# EAGLE design tms9918 (EAGLE 9.4.2)

## Sheet 1 of 2: Bus interface
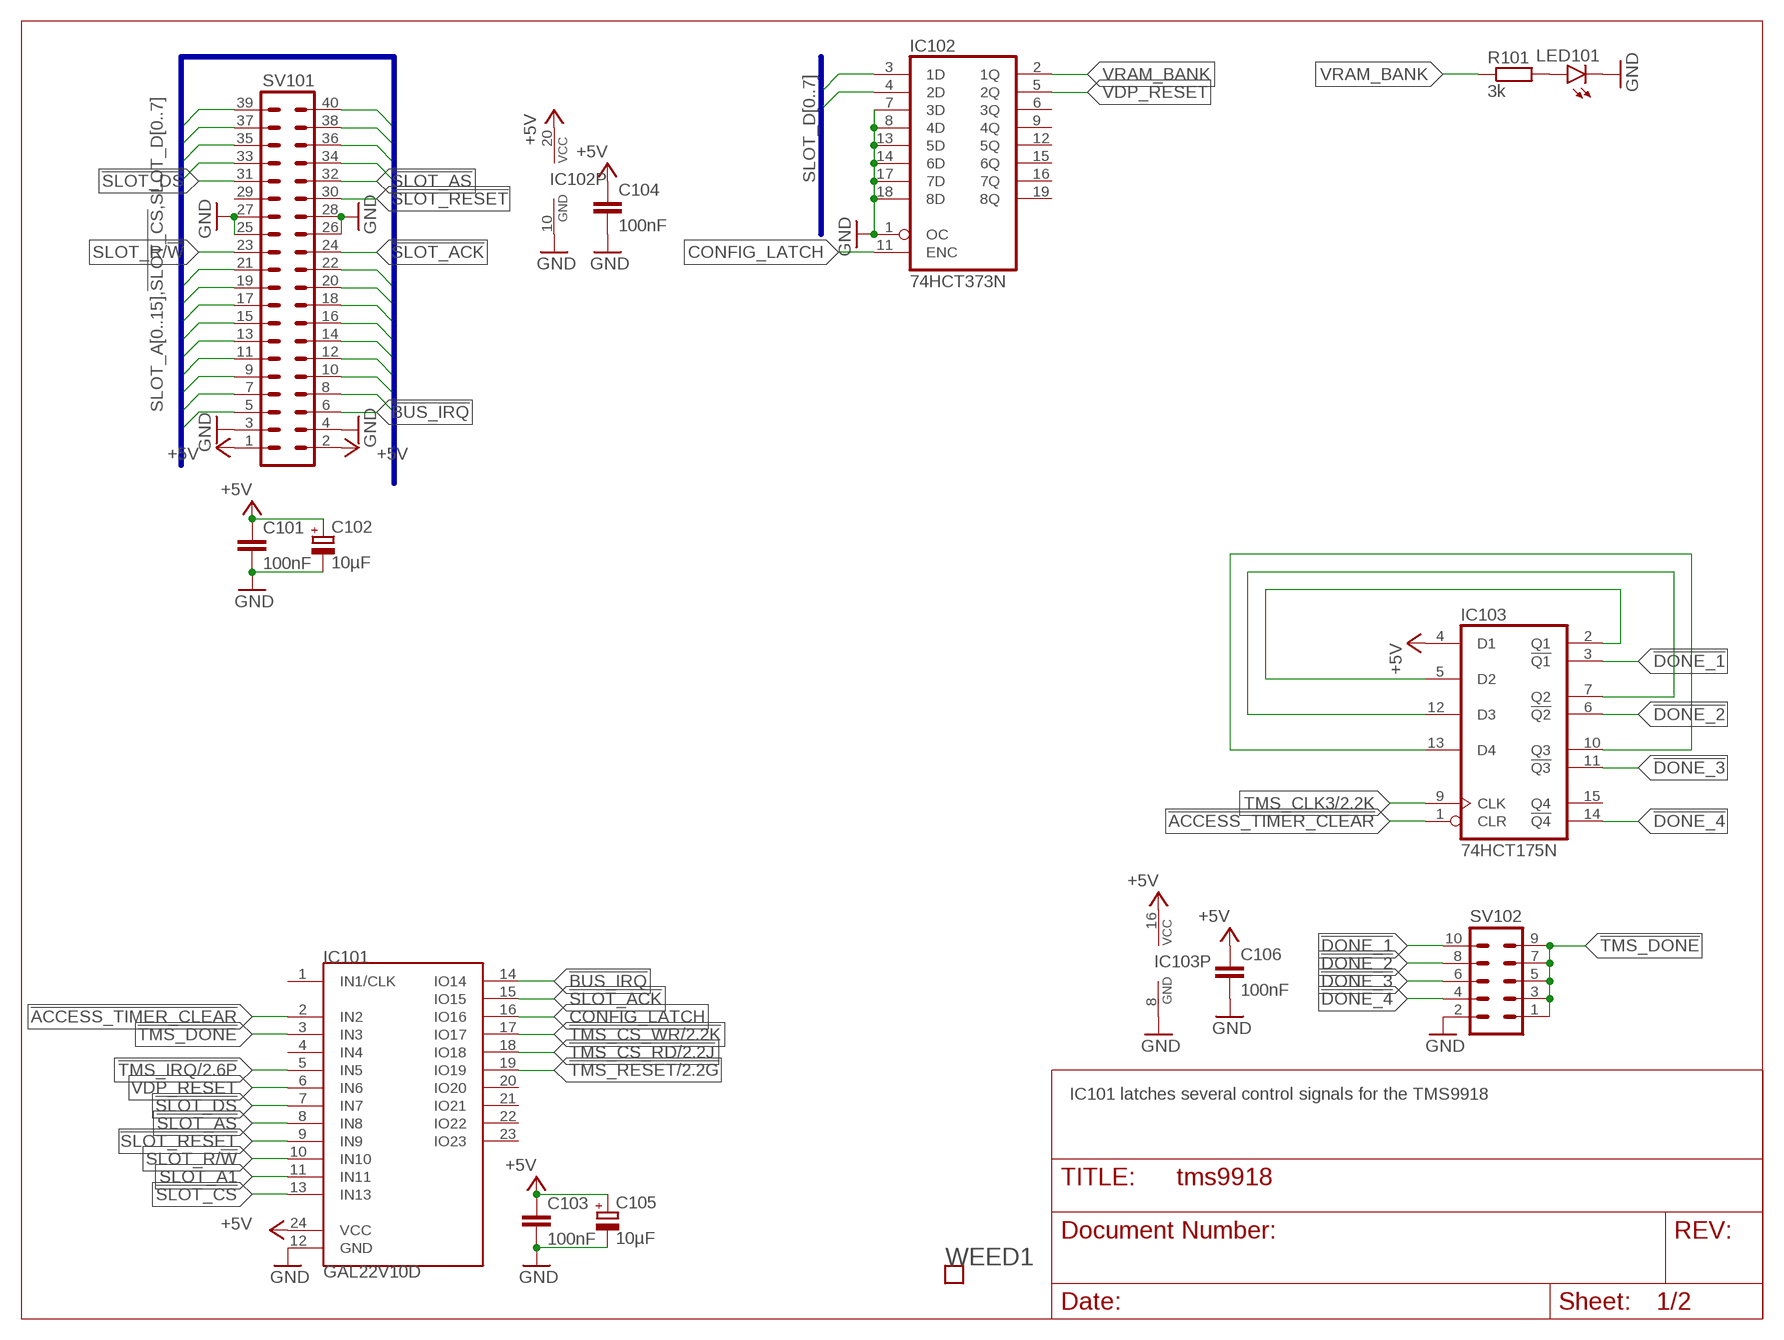
[diagram p0: schematic, sheet 1]

### Parts
C101  100nF  C-EUC0805  [C0805]
C102  10µF  CPOL-EUSMCB  [SMC_B]
C103  100nF  C-EUC0805  [C0805]
C104  100nF  C-EUC0805  [C0805]
C105  10µF  CPOL-EUSMCB  [SMC_B]
C106  100nF  C-EUC0805  [C0805]
IC101  GAL22V10D  GAL22V10DIP24  [DIL24S]
IC102  74HCT373N  [DIL20]
IC103  74HCT175N  [DIL16]
LED101  LEDCHIPLED_1206  [CHIPLED_1206]
R101  3k  R-EU_R2012  [R2012]
SV101  MA20-2W  [MA20-2W]
SV102  MA05-2  [MA05-2]
WEED1  WEED  [DOINK]

### Nets
!ACCESS_TIMER_CLEAR: IC101.2(IN2) IC103.1(CLR)
!BUS_IRQ: IC101.14(IO14) SV101.6
!DONE_1: IC103.3(!Q1) SV102.10
!DONE_2: IC103.6(!Q2) SV102.8
!DONE_3: IC103.11(!Q3) SV102.6
!DONE_4: IC103.14(!Q4) SV102.4
!SLOT_ACK: IC101.15(IO15) SV101.24
!SLOT_AS: IC101.8(IN8) SV101.32
!SLOT_CS: IC101.13(IN13) SV101.5
!SLOT_DS: IC101.7(IN7) SV101.31
!SLOT_RESET: IC101.9(IN9) SV101.30
!TMS_CS_RD: IC101.18(IO18) ; also sheet 2
!TMS_CS_WR: IC101.17(IO17) ; also sheet 2
!TMS_DONE: IC101.3(IN3) SV102.1 SV102.3 SV102.5 SV102.7 SV102.9
!TMS_IRQ: IC101.5(IN5) ; also sheet 2
!TMS_RESET: IC101.19(IO19) ; also sheet 2
+5V: C101.1 C102.+ C103.1 C104.1 C105.+ C106.1 IC101.24(VCC) IC102.20(VCC) IC103.4(D1) IC103.16(VCC) SV101.1 SV101.2 ; also sheet 2
CONFIG_LATCH: IC101.16(IO16) IC102.11(ENC)
GND: C101.2 C102.- C103.2 C104.2 C105.- C106.2 IC101.12(GND) IC102.1(OC) IC102.7(3D) IC102.8(4D) IC102.10(GND) IC102.13(5D) IC102.14(6D) IC102.17(7D) IC102.18(8D) IC103.8(GND) LED101.C SV101.3 SV101.4 SV101.25 SV101.26 SV101.27 SV101.28 SV102.2 ; also sheet 2
N$8: IC103.2(Q1) IC103.5(D2)
N$9: IC103.7(Q2) IC103.12(D3)
N$10: IC103.10(Q3) IC103.13(D4)
N$11: LED101.A R101.2
SLOT_A0: SV101.12 ; also sheet 2
SLOT_A1: IC101.11(IN11) SV101.10
SLOT_A2: SV101.8
SLOT_A3: SV101.7
SLOT_A4: SV101.9
SLOT_A5: SV101.11
SLOT_A6: SV101.14
SLOT_A7: SV101.13
SLOT_A8: SV101.16
SLOT_A9: SV101.15
SLOT_A10: SV101.18
SLOT_A11: SV101.17
SLOT_A12: SV101.20
SLOT_A13: SV101.19
SLOT_A14: SV101.22
SLOT_A15: SV101.21
SLOT_D0: IC102.3(1D) SV101.35 ; also sheet 2
SLOT_D1: IC102.4(2D) SV101.37 ; also sheet 2
SLOT_D2: SV101.39 ; also sheet 2
SLOT_D3: SV101.40 ; also sheet 2
SLOT_D4: SV101.38 ; also sheet 2
SLOT_D5: SV101.36 ; also sheet 2
SLOT_D6: SV101.34 ; also sheet 2
SLOT_D7: SV101.33 ; also sheet 2
SLOT_R/!W!: IC101.10(IN10) SV101.23
TMS_CLK3: IC103.9(CLK) ; also sheet 2
VDP_RESET: IC101.6(IN6) IC102.5(2Q)
VRAM_BANK: IC102.2(1Q) R101.1 ; also sheet 2
Unconnected: IC101.1(IN1/CLK) IC101.4(IN4) IC101.20(IO20) IC101.21(IO21) IC101.22(IO22) IC101.23(IO23) IC102.6(3Q) IC102.9(4Q) IC102.12(5Q) IC102.15(6Q) IC102.16(7Q) IC102.19(8Q) IC103.15(Q4) SV101.29

### Buses
SLOT_A[0..15],!SLOT_CS,SLOT_D[0..7]
SLOT_D[0..7]

### Notes on the sheet
- IC101 latches several control signals for the TMS9918

## Sheet 2 of 2: Video Controller/DRAM Emulation
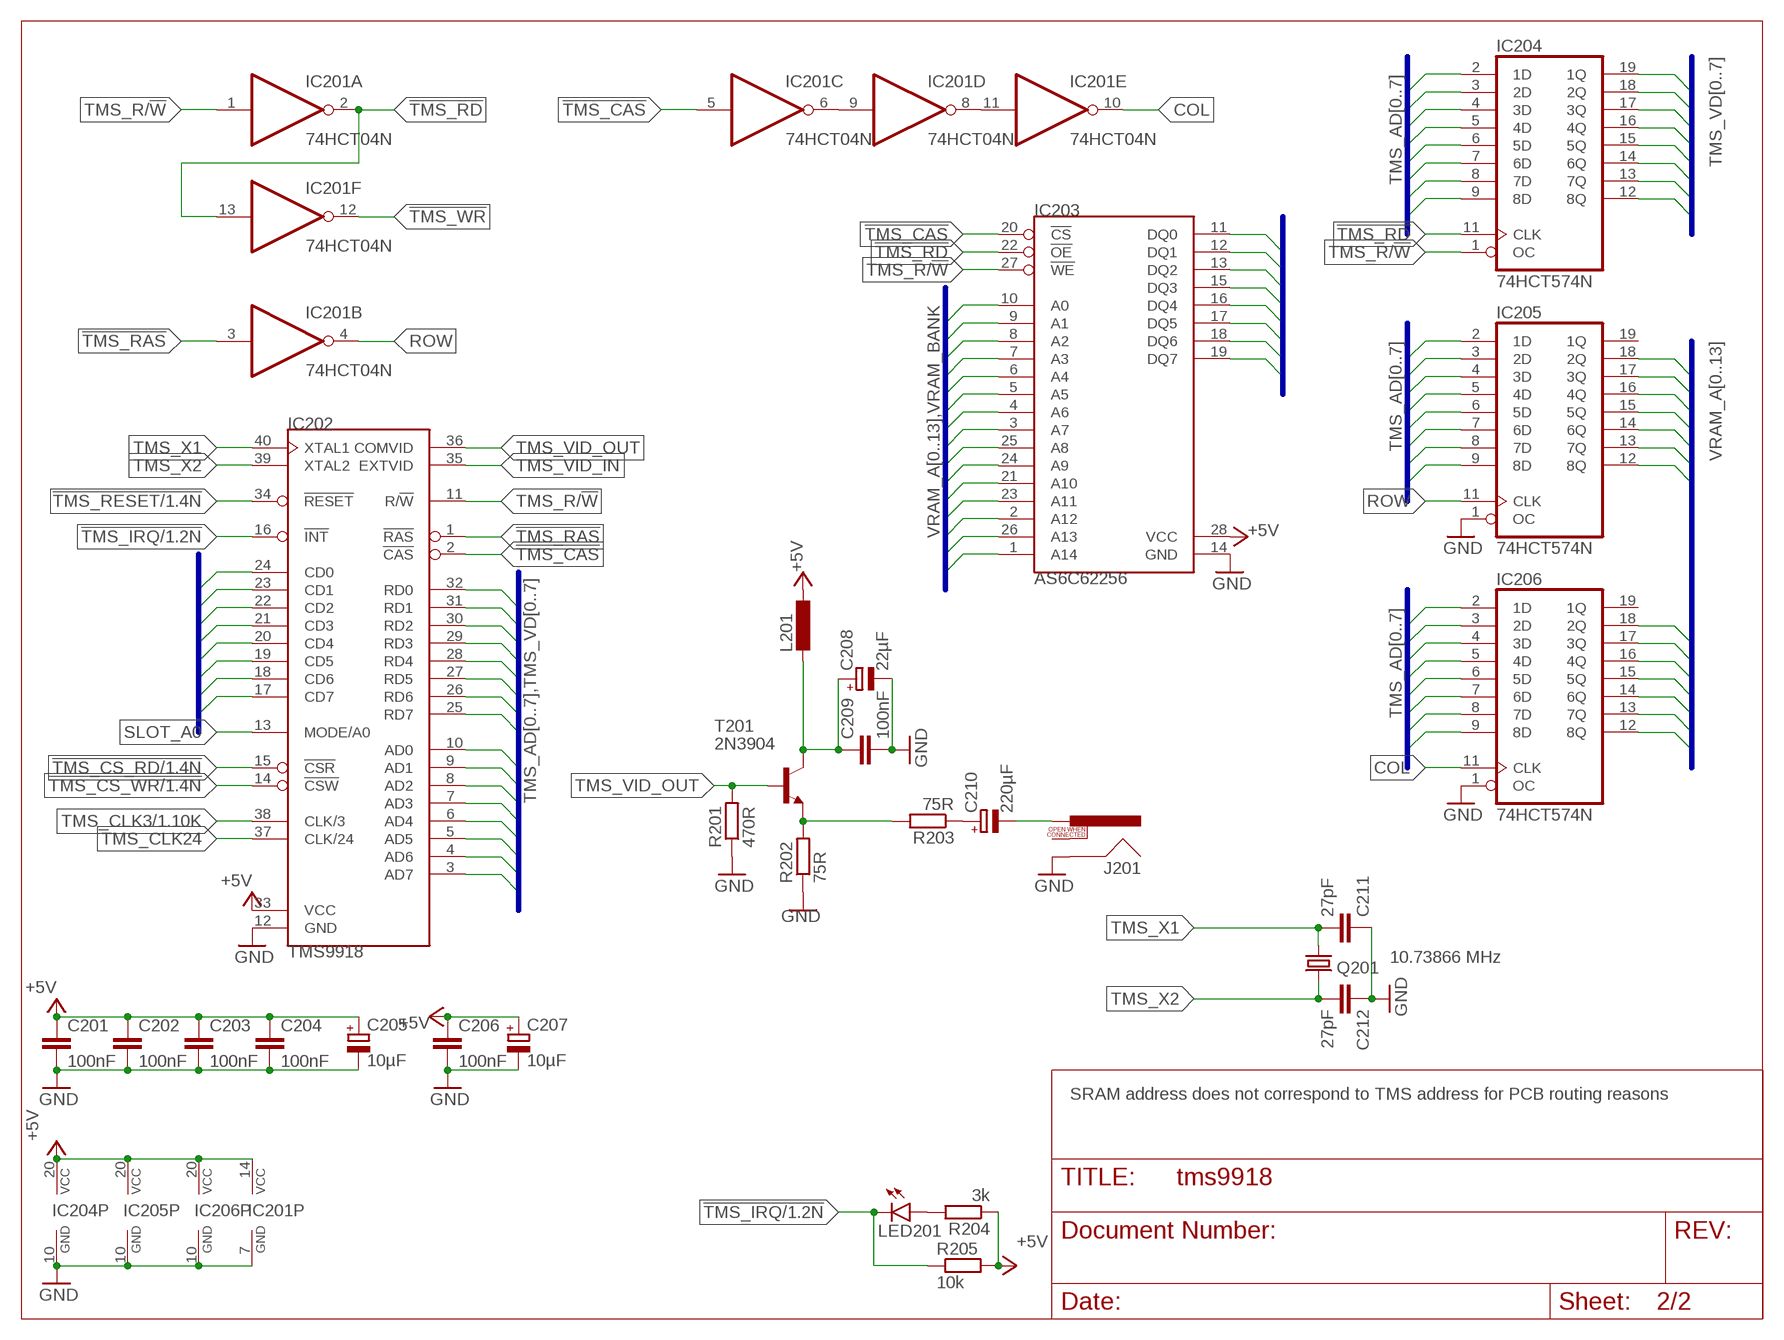
[diagram p1: schematic, sheet 2]

### Parts
C201  100nF  C-EUC0805  [C0805]
C202  100nF  C-EUC0805  [C0805]
C203  100nF  C-EUC0805  [C0805]
C204  100nF  C-EUC0805  [C0805]
C205  10µF  CPOL-EUSMCB  [SMC_B]
C206  100nF  C-EUC0805  [C0805]
C207  10µF  CPOL-EUSMCB  [SMC_B]
C208  22µF  CPOL-EUE2-5  [E2-5]
C209  100nF  C-EUC0805  [C0805]
C210  220µF  CPOL-EUE2.5-7  [E2,5-7]
C211  27pF  C-EUC0805  [C0805]
C212  27pF  C-EUC0805  [C0805]
IC201  74HCT04N  [DIL14]
IC202  TMS9918  [DIL40]
IC203  AS6C62256  [DIL28-6]
IC204  74HCT574N  [DIL20]
IC205  74HCT574N  [DIL20]
IC206  74HCT574N  [DIL20]
J201  RCALOCK  [RCA_LOCK]
L201  L-EUL2012C  [L2012C]
LED201  LEDCHIPLED_1206  [CHIPLED_1206]
Q201  10.73866 MHz  CRYSTALHC49S  [HC49/S]
R201  470R  R-EU_R2012  [R2012]
R202  75R  R-EU_R2012  [R2012]
R203  75R  R-EU_R2012  [R2012]
R204  3k  R-EU_R2012  [R2012]
R205  10k  R-EU_R2012  [R2012]
T201  2N3904  [TO92]

### Nets
!TMS_CAS: IC201.5(C:I) IC202.2(!CAS) IC203.20(!CS)
!TMS_CS_RD: IC202.15(!CSR) ; also sheet 1
!TMS_CS_WR: IC202.14(!CSW) ; also sheet 1
!TMS_IRQ: IC202.16(!INT) LED201.C R205.1 ; also sheet 1
!TMS_RAS: IC201.3(B:I) IC202.1(!RAS)
!TMS_RD: IC201.2(A:O) IC201.13(F:I) IC203.22(!OE) IC204.11(CLK)
!TMS_RESET: IC202.34(!RESET) ; also sheet 1
!TMS_WR: IC201.12(F:O)
+5V: C201.1 C202.1 C203.1 C204.1 C205.+ C206.1 C207.+ IC201.14(P:VCC) IC202.33(VCC) IC203.28(VCC) IC204.20(VCC) IC205.20(VCC) IC206.20(VCC) L201.1 R204.1 R205.2 ; also sheet 1
COL: IC201.10(E:O) IC206.11(CLK)
GND: C201.2 C202.2 C203.2 C204.2 C205.- C206.2 C207.- C208.- C209.2 C211.1 C212.1 IC201.7(P:GND) IC202.12(GND) IC203.14(GND) IC204.10(GND) IC205.1(OC) IC205.10(GND) IC206.1(OC) IC206.10(GND) J201.SHELL R201.1 R202.1 ; also sheet 1
N$1: IC201.8(D:O) IC201.11(E:I)
N$2: IC201.6(C:O) IC201.9(D:I)
N$3: C208.+ C209.1 L201.2 T201.1(C)
N$4: R202.2 R203.2 T201.3(E)
N$5: C210.+ R203.1
N$6: C210.- J201.PIN
N$7: LED201.A R204.2
ROW: IC201.4(B:O) IC205.11(CLK)
SLOT_A0: IC202.13(MODE/A0) ; also sheet 1
SLOT_D0: IC202.17(CD7) ; also sheet 1
SLOT_D1: IC202.18(CD6) ; also sheet 1
SLOT_D2: IC202.19(CD5) ; also sheet 1
SLOT_D3: IC202.20(CD4) ; also sheet 1
SLOT_D4: IC202.21(CD3) ; also sheet 1
SLOT_D5: IC202.22(CD2) ; also sheet 1
SLOT_D6: IC202.23(CD1) ; also sheet 1
SLOT_D7: IC202.24(CD0) ; also sheet 1
TMS_AD0: IC202.10(AD0) IC204.2(1D) IC205.9(8D) IC206.9(8D)
TMS_AD1: IC202.9(AD1) IC204.3(2D) IC205.8(7D) IC206.8(7D)
TMS_AD2: IC202.8(AD2) IC204.4(3D) IC205.7(6D) IC206.7(6D)
TMS_AD3: IC202.7(AD3) IC204.5(4D) IC205.6(5D) IC206.6(5D)
TMS_AD4: IC202.6(AD4) IC204.6(5D) IC205.5(4D) IC206.5(4D)
TMS_AD5: IC202.5(AD5) IC204.7(6D) IC205.4(3D) IC206.4(3D)
TMS_AD6: IC202.4(AD6) IC204.8(7D) IC205.3(2D) IC206.3(2D)
TMS_AD7: IC202.3(AD7) IC204.9(8D) IC205.2(1D) IC206.2(1D)
TMS_CLK3: IC202.38(CLK/3) ; also sheet 1
TMS_CLK24: IC202.37(CLK/24)
TMS_R/!W!: IC201.1(A:I) IC202.11(R/!W!) IC203.27(!WE) IC204.1(OC)
TMS_VD0: IC202.32(RD0) IC203.11(DQ0) IC204.19(1Q)
TMS_VD1: IC202.31(RD1) IC203.12(DQ1) IC204.18(2Q)
TMS_VD2: IC202.30(RD2) IC203.13(DQ2) IC204.17(3Q)
TMS_VD3: IC202.29(RD3) IC203.15(DQ3) IC204.16(4Q)
TMS_VD4: IC202.28(RD4) IC203.16(DQ4) IC204.15(5Q)
TMS_VD5: IC202.27(RD5) IC203.17(DQ5) IC204.14(6Q)
TMS_VD6: IC202.26(RD6) IC203.18(DQ6) IC204.13(7Q)
TMS_VD7: IC202.25(RD7) IC203.19(DQ7) IC204.12(8Q)
TMS_VID_IN: IC202.35(EXTVID)
TMS_VID_OUT: IC202.36(COMVID) R201.2 T201.2(B)
TMS_X1: C211.2 IC202.40(XTAL1) Q201.1
TMS_X2: C212.2 IC202.39(XTAL2) Q201.2
VRAM_A0: IC203.10(A0) IC205.12(8Q)
VRAM_A1: IC203.9(A1) IC205.13(7Q)
VRAM_A2: IC203.8(A2) IC205.14(6Q)
VRAM_A3: IC203.7(A3) IC205.15(5Q)
VRAM_A4: IC203.6(A4) IC205.16(4Q)
VRAM_A5: IC203.5(A5) IC205.17(3Q)
VRAM_A6: IC203.4(A6) IC205.18(2Q)
VRAM_A7: IC203.3(A7) IC206.17(3Q)
VRAM_A8: IC203.25(A8) IC206.15(5Q)
VRAM_A9: IC203.24(A9) IC206.14(6Q)
VRAM_A10: IC203.21(A10) IC206.12(8Q)
VRAM_A11: IC203.23(A11) IC206.13(7Q)
VRAM_A12: IC203.2(A12) IC206.18(2Q)
VRAM_A13: IC203.26(A13) IC206.16(4Q)
VRAM_BANK: IC203.1(A14) ; also sheet 1
Unconnected: IC205.19(1Q) IC206.19(1Q) J201.SWITCH

### Buses
TMS_VD[0..7]
VRAM_A[0..13]
TMS_AD[0..7]
VRAM_A[0..13],VRAM_BANK
TMS_AD[0..7],TMS_VD[0..7]
SLOT_D[0..7]

### Notes on the sheet
- SRAM address does not correspond to TMS address for PCB routing reasons

## Library data of the parts
C101 C103 C104 C106 C201-C204 C206 C209 = rcl:C-EU: CAPACITOR, European symbol; MOUSER: 710-885012207072; SPICEPREFIX: C
C102 C105 C205 C207 = rcl:CPOL-EU: POLARIZED CAPACITOR, European symbol; MOUSER: 581-TAJB106K020RNJV; SPICEPREFIX: C
C208 = rcl:CPOL-EU: POLARIZED CAPACITOR, European symbol; MOUSER: 710-860010372002; SPICEPREFIX: C
C210 = rcl:CPOL-EU: POLARIZED CAPACITOR, European symbol; MOUSER: 710-860020373010; SPICEPREFIX: C
C211 C212 = rcl:C-EU: CAPACITOR, European symbol; MOUSER: 80-C0805C270K5HACTU; SPICEPREFIX: C
IC101 = 68komputer:GAL22V10: GAL22V10D – Generic Array Logic Datasheet <http://web.mit.edu/6.115/www/document/gal22v10.pdf>; MOUSER_SOCKET: 575-11044324
IC102 = 74xx-eu:74*373: Octal D type transparent LATCH, edge triggered; MOUSER: 595-SN74HCT373N; MOUSER_SOCKET: 575-1104732041001000
IC103 = 74xx-eu:74*175: Qadruple D type FLIP FLOP, clear; MOUSER: 595-CD74HCT175E; MOUSER_SOCKET: 575-1104731641001000
IC201 = 74xx-eu:74*04: Hex INVERTER; MOUSER: 595-SN74HCT04N; MOUSER_SOCKET: 575-1104731441001000
IC202 = 68komputer:TMS9918: TMSS9918 – Video Display Processor Datasheet <http://www.bitsavers.org/components/ti/TMS9900/TMS9918A_TMS9928A_TMS9929A_Video_Display_Processors_Data_Manual_Nov82.pdf>; MOUSER_SOCKET: 437-1108764041001101
IC203 = 68komputer:AS6C62256: AS6C62256 – 32K x 8 bit SRAM Datasheet <https://www.mouser.com/datasheet/2/12/AS6C62256%2023%20March%202016%20rev1.2-1288423.pdf>; MOUSER: 913-AS6C62256-55PCN; MOUSER_SOCKET: 575-1104762841001000
IC204-IC206 = 74xx-eu:74*574: 8-bit D type FLIP FLOP bus driver; MOUSER: 595-SN74HCT574N; MOUSER_SOCKET: 575-1104732041001000
J201 = SparkFun-Connectors:RCA: RCA Jack connector This is a right angle RCA jack connecotr. Commonly used for video or audio. Here is the connector we sell at SparkFun: RCA Jack <https://www.sparkfun.com/products/8631> (PRT-08631) Datasheet <http://www.sparkfun.com/datasheets/Prototyping/Connectors/RCA-Jack.pdf> It is not used on any active designs, however it was used on a couple retired products: RCA Jack Breakout [RETIRED] <https://www.sparkfun.com/products/8826> (PRT-08826) SparkFun On Screen Display Breakout - MAX7456 [RETIRED] <https://www.sparkfun.com/products/9168> (BOB-09168) You may also be interested in a cable: RCA Video Cable - 6' <https://www.sparkfun.com/products/11573> (CAB-11573); MOUSER: 502-PJRAN1X1U04AU
L201 = rcl:L-EU: INDUCTOR, European symbol; MOUSER: 963-BK2125HS101-T; SPICEPREFIX: L
LED101 LED201 = led:LED: LED OSRAM: - CHIPLED LG R971, LG N971, LY N971, LG Q971, LY Q971, LO R971, LY R971 LH N974, LH R974 LS Q976, LO Q976, LY Q976 LO Q996 - Hyper CHIPLED LW Q18S LB Q993, LB Q99A, LB R99A - SideLED LS A670, LO A670, LY A670, LG A670, LP A670 LB A673, LV A673, LT A673, LW A673 LH A674 LY A675 LS A676, LA A676, LO A676, LY A676, LW A676 LS A679, LY A679, LG A679 - Hyper Micro SIDELED® LS Y876, LA Y876, LO Y876, LY Y876 LT Y87S - SmartLED LW L88C, LW L88S LB L89C, LB L89S, LG L890 LS L89K, LO L89K, LY L89K LS L896, LA L896, LO L896, LY L896 - TOPLED LS T670, LO T670, LY T670, LG T670, LP T670 LSG T670, LSP T670, LSY T670, LOP T670, LYG T670 LG T671, LOG T671, LSG T671 LB T673, LV T673, LT T673, LW T673 LH T674 LS T676, LA T676, LO T676, LY T676, LB T676, LH T676, LSB T676, LW T676 LB T67C, LV T67C, LT T67C, LS T67K, LO T67K, LY T67K, LW E67C LS E67B, LA E67B, LO E67B, LY E67B, LB E67C, LV E67C, LT E67C LW T67C LS T679, LY T679, LG T679 LS T770, LO T770, LY T770, LG T770, LP T770 LB T773, LV T773, LT T773, LW T773 LH T774 LS E675, LA E675, LY E675, LS T675 LS T776, LA T776, LO T776, LY T776, LB T776 LHGB T686 LT T68C, LB T68C - Hyper Mini TOPLED® LB M676 - Mini TOPLED Santana® LG M470 LS M47K, LO M47K, LY M47K Source: http://www.osram.convergy.de LUXEON: - LUMILED® LXK2-PW12-R00, LXK2-PW12-S00, LXK2-PW14-U00, LXK2-PW14-V00 LXK2-PM12-R00, LXK2-PM12-S00, LXK2-PM14-U00 LXK2-PE12-Q00, LXK2-PE12-R00, LXK2-PE12-S00, LXK2-PE14-T00, LXK2-PE14-U00 LXK2-PB12-K00, LXK2-PB12-L00, LXK2-PB12-M00, LXK2-PB14-N00, LXK2-PB14-P00, LXK2-PB14-Q00 LXK2-PR12-L00, LXK2-PR12-M00, LXK2-PR14-Q00, LXK2-PR14-R00 LXK2-PD12-Q00, LXK2-PD12-R00, LXK2-PD12-S00 LXK2-PH12-R00, LXK2-PH12-S00 LXK2-PL12-P00, LXK2-PL12-Q00, LXK2-PL12-R00 Source: www.luxeon.com KINGBRIGHT: KA-3528ASYC Source: www.kingbright.com; MOUSER: 710-156120VS75300
Q201 = crystal:CRYSTAL: CRYSTAL; MOUSER: 449-LFXTAL029962REEL; OC_FARNELL: 1667008; OC_NEWARK: unknown
R101 R204 = rcl:R-EU_: RESISTOR, European symbol; MOUSER: 652-CR0805JW-302ELF; SPICEPREFIX: R
R201 = rcl:R-EU_: RESISTOR, European symbol; MOUSER: 652-CR0805FX-4700ELF; SPICEPREFIX: R
R202 R203 = rcl:R-EU_: RESISTOR, European symbol; MOUSER: 652-CR0805FX-75R0ELF; SPICEPREFIX: R
R205 = rcl:R-EU_: RESISTOR, European symbol; MOUSER: 652-CR0805FX-1002ELF; SPICEPREFIX: R
SV101 = con-lstb:MA20-2W: PIN HEADER; OC_FARNELL: unknown; OC_NEWARK: unknown
SV102 = con-lstb:MA05-2: PIN HEADER; OC_FARNELL: unknown; OC_NEWARK: unknown
T201 = transistor-neu-to92:2N3904: NPN TRANSISTOR; MOUSER: 512-2N3904BU
WEED1 = 68komputer:WEED

## Net classes
0 default: width 0.203 mm

## Board
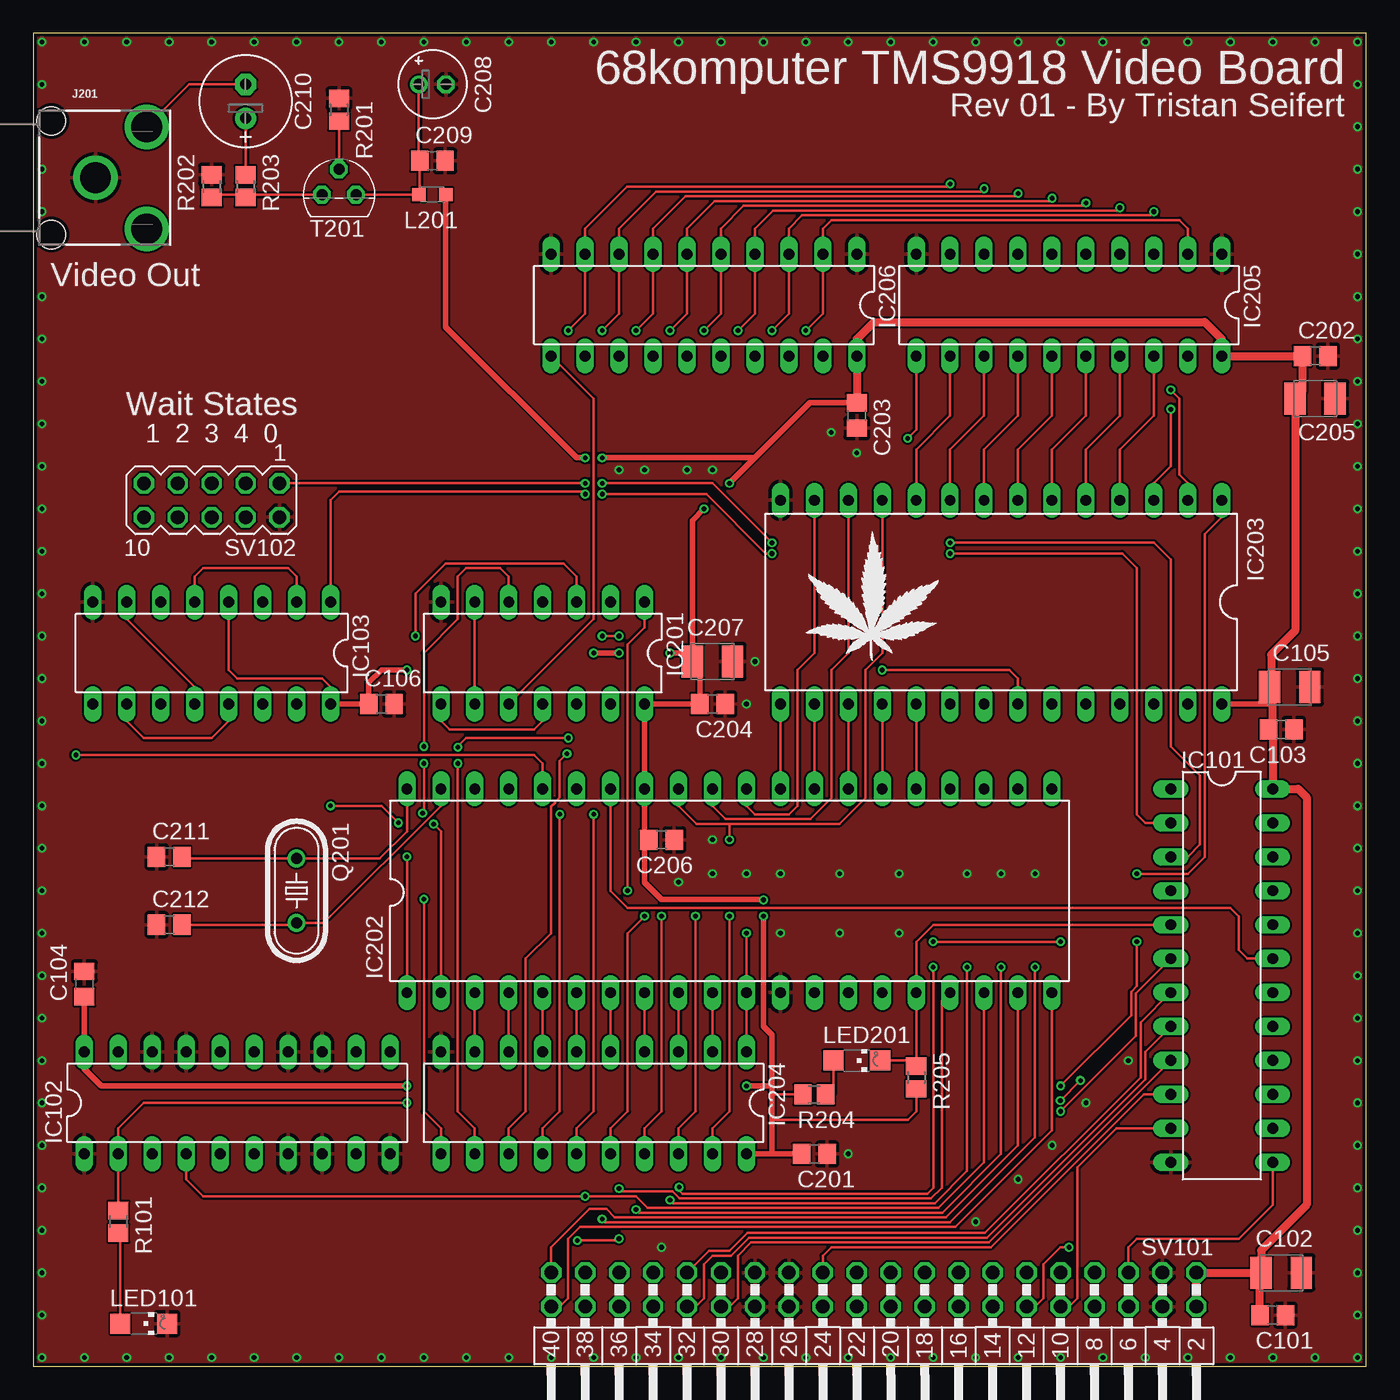
[diagram p2: board, top side]
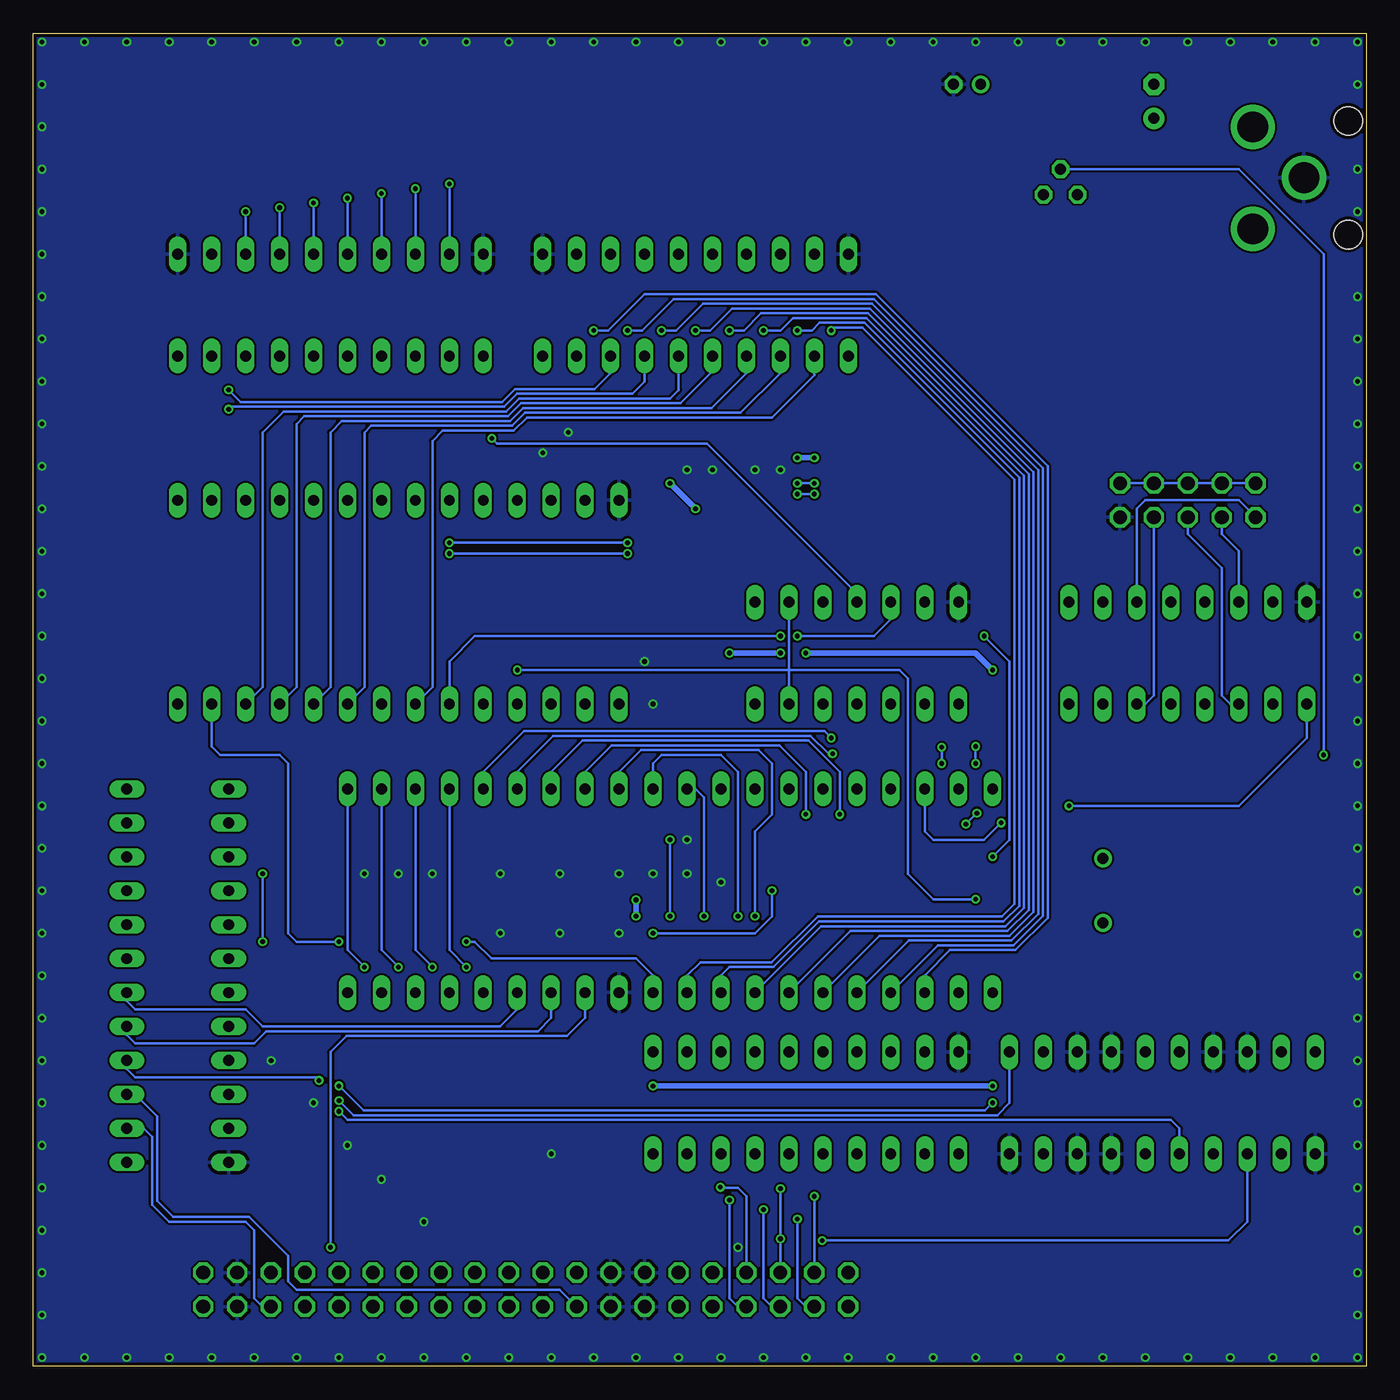
[diagram p3: board, bottom side, seen from below]

Size 99.69 x 99.69 mm. Coordinates in mm from the lower left corner, seen from the top.
Outline: 0,0 99.69,0 99.69,99.69 0,99.69 0,0
Copper layers (1*16): Top 0.035mm / dielectric 1.5mm / Bottom 0.035mm
Design rules "dirt_cheap_dirty_boards.v1.1": minimum track width 6mil, minimum drill 12mil, track to track 6mil, track to pad 6mil, pad to pad 6mil, via to via 6mil, smd to smd 0mil, copper to edge 10mil, drill to drill 10mil, minimum pad ring 10mil, minimum via ring 6mil, stop-mask expansion 2mil, vias tented up to drill 25mil, thermal gap 10mil

### Footprints (pad centres in the part's own frame; a part is rotated, then mirrored left to right if it is on the bottom)
C0805 = smd 1.3 x 1.5: 1 -0.95,0; 2 0.95,0
SMC_B = smd 1.6 x 2.4: + -1.5,0; - 1.5,0
E2-5 = drill 0.813 pad 1.27: + -1.016,0 | drill 0.813 pad 1.27 octagon: - 1.016,0
E2,5-7 = drill 0.813 pad 1.6: + -1.27,0 | drill 0.813 pad 1.6 octagon: - 1.27,0
DIL24S = drill 0.813 long: 1 -13.97,-3.81; 2 -11.43,-3.81; 3 -8.89,-3.81; 4 -6.35,-3.81; 5 -3.81,-3.81; 6 -1.27,-3.81; 7 1.27,-3.81; 8 3.81,-3.81; 9 6.35,-3.81; 10 8.89,-3.81; 11 11.43,-3.81; 12 13.97,-3.81; 13 13.97,3.81; 14 11.43,3.81; 15 8.89,3.81; 16 6.35,3.81; 17 3.81,3.81; 18 1.27,3.81; 19 -1.27,3.81; 20 -3.81,3.81; 21 -6.35,3.81; 22 -8.89,3.81; 23 -11.43,3.81; 24 -13.97,3.81
DIL20 = drill 0.813 long: 1 -11.43,-3.81; 2 -8.89,-3.81; 3 -6.35,-3.81; 4 -3.81,-3.81; 5 -1.27,-3.81; 6 1.27,-3.81; 7 3.81,-3.81; 8 6.35,-3.81; 9 8.89,-3.81; 10 11.43,-3.81; 11 11.43,3.81; 12 8.89,3.81; 13 6.35,3.81; 14 3.81,3.81; 15 1.27,3.81; 16 -1.27,3.81; 17 -3.81,3.81; 18 -6.35,3.81; 19 -8.89,3.81; 20 -11.43,3.81
DIL16 = drill 0.813 long: 1 -8.89,-3.81; 2 -6.35,-3.81; 3 -3.81,-3.81; 4 -1.27,-3.81; 5 1.27,-3.81; 6 3.81,-3.81; 7 6.35,-3.81; 8 8.89,-3.81; 9 8.89,3.81; 10 6.35,3.81; 11 3.81,3.81; 12 1.27,3.81; 13 -1.27,3.81; 14 -3.81,3.81; 15 -6.35,3.81; 16 -8.89,3.81
DIL14 = drill 0.813 long: 1 -7.62,-3.81; 2 -5.08,-3.81; 3 -2.54,-3.81; 4 0,-3.81; 5 2.54,-3.81; 6 5.08,-3.81; 7 7.62,-3.81; 8 7.62,3.81; 9 5.08,3.81; 10 2.54,3.81; 11 0,3.81; 12 -2.54,3.81; 13 -5.08,3.81; 14 -7.62,3.81
DIL40 = drill 0.813 long: 1 -24.13,-7.62; 2 -21.59,-7.62; 3 -19.05,-7.62; 4 -16.51,-7.62; 5 -13.97,-7.62; 6 -11.43,-7.62; 7 -8.89,-7.62; 8 -6.35,-7.62; 9 -3.81,-7.62; 10 -1.27,-7.62; 11 1.27,-7.62; 12 3.81,-7.62; 13 6.35,-7.62; 14 8.89,-7.62; 15 11.43,-7.62; 16 13.97,-7.62; 17 16.51,-7.62; 18 19.05,-7.62; 19 21.59,-7.62; 20 24.13,-7.62; 21 24.13,7.62; 22 21.59,7.62; 23 19.05,7.62; 24 16.51,7.62; 25 13.97,7.62; 26 11.43,7.62; 27 8.89,7.62; 28 6.35,7.62; 29 3.81,7.62; 30 1.27,7.62; 31 -1.27,7.62; 32 -3.81,7.62; 33 -6.35,7.62; 34 -8.89,7.62; 35 -11.43,7.62; 36 -13.97,7.62; 37 -16.51,7.62; 38 -19.05,7.62; 39 -21.59,7.62; 40 -24.13,7.62
DIL28-6 = drill 0.813 long: 1 -16.51,-7.62; 2 -13.97,-7.62; 3 -11.43,-7.62; 4 -8.89,-7.62; 5 -6.35,-7.62; 6 -3.81,-7.62; 7 -1.27,-7.62; 8 1.27,-7.62; 9 3.81,-7.62; 10 6.35,-7.62; 11 8.89,-7.62; 12 11.43,-7.62; 13 13.97,-7.62; 14 16.51,-7.62; 15 16.51,7.62; 16 13.97,7.62; 17 11.43,7.62; 18 8.89,7.62; 19 6.35,7.62; 20 3.81,7.62; 21 1.27,7.62; 22 -1.27,7.62; 23 -3.81,7.62; 24 -6.35,7.62; 25 -8.89,7.62; 26 -11.43,7.62; 27 -13.97,7.62; 28 -16.51,7.62
RCA_LOCK = drill 2.3: PIN 4.03,3.802; SHELL 0.203,0; SWITCH 4.03,-3.827 | hole 2.134: -3.1,4.25; -3.1,-4.25
L2012C = smd 1 x 1: 1 -1,0; 2 1,0
CHIPLED_1206 = smd 1.5 x 1.5: A 0,-1.75; C 0,1.75
HC49/S = drill 0.813: 1 -2.413,0; 2 2.413,0
R2012 = smd 1.3 x 1.5: 1 -0.85,0; 2 0.85,0
MA20-2W = drill 1.016 octagon: 1 -24.13,-1.27; 2 -24.13,1.27; 3 -21.59,-1.27; 4 -21.59,1.27; 5 -19.05,-1.27; 6 -19.05,1.27; 7 -16.51,-1.27; 8 -16.51,1.27; 9 -13.97,-1.27; 10 -13.97,1.27; 11 -11.43,-1.27; 12 -11.43,1.27; 13 -8.89,-1.27; 14 -8.89,1.27; 15 -6.35,-1.27; 16 -6.35,1.27; 17 -3.81,-1.27; 18 -3.81,1.27; 19 -1.27,-1.27; 20 -1.27,1.27; 21 1.27,-1.27; 22 1.27,1.27; 23 3.81,-1.27; 24 3.81,1.27; 25 6.35,-1.27; 26 6.35,1.27; 27 8.89,-1.27; 28 8.89,1.27; 29 11.43,-1.27; 30 11.43,1.27; 31 13.97,-1.27; 32 13.97,1.27; 33 16.51,-1.27; 34 16.51,1.27; 35 19.05,-1.27; 36 19.05,1.27; 37 21.59,-1.27; 38 21.59,1.27; 39 24.13,-1.27; 40 24.13,1.27
MA05-2 = drill 1.016 octagon: 1 -5.08,-1.27; 2 -5.08,1.27; 3 -2.54,-1.27; 4 -2.54,1.27; 5 0,-1.27; 6 0,1.27; 7 2.54,-1.27; 8 2.54,1.27; 9 5.08,-1.27; 10 5.08,1.27
TO92 = drill 0.813 octagon: 1 1.27,0; 2 0,1.905; 3 -1.27,0

### Placement (x,y rotation side)
C101  92.71,3.81 0 top
C102  93.34,6.99 0 top
C103  93.34,47.62 0 top
C104  3.81,28.57 90 top
C105  93.98,50.8 0 top
C106  26.04,49.53 0 top
C201  58.42,15.88 0 top
C202  95.89,75.56 0 top
C203  61.59,71.12 270 top
C204  50.8,49.53 0 top
C205  95.89,72.39 0 top
C206  46.99,39.37 0 top
C207  50.8,52.7 0 top
C208  29.84,95.89 0 top
C209  29.84,90.17 0 top
C210  15.88,94.61 90 top
C211  10.16,38.1 0 top
C212  10.16,33.02 0 top
IC101  88.9,29.21 270 top
IC102  15.24,19.68 0 top
IC103  13.34,53.34 180 top
IC201  38.1,53.34 180 top
IC202  52.07,35.56 0 top
IC203  72.39,57.15 180 top
IC204  41.91,19.68 180 top
IC205  77.47,79.38 180 top
IC206  50.16,79.38 180 top
J201  4.45,88.9 0 top
L201  29.84,87.63 180 top
LED101  8.26,3.17 270 top
LED201  61.59,22.86 270 top
Q201  19.68,35.56 270 top
R101  6.35,10.79 270 top
R201  22.86,93.98 270 top
R202  13.34,88.27 270 top
R203  15.88,88.27 270 top
R204  58.42,20.32 0 top
R205  66.04,21.59 270 top
SV101  62.87,5.71 180 top
SV102  13.34,64.77 180 top
T201  22.86,87.63 0 top
WEED1  57.78,52.7 0 top

### Tracks (layer width: path | path; a pad name or v marks a point on that pad's centre or on a via)
!ACCESS_TIMER_CLEAR  (via drill 0.35)
  Top 0.203: IC103.1 22.23,64.77 22.86,65.41 41.1,65.41 v41.27,65.23 | v42.55,65.23 50.34,65.23 54.78,60.79 v55.24,60.79 | v68.58,60.79 81.45,60.79 82.55,59.69 82.55,41.27 83.19,40.64 IC101.2
  Bottom 0.203: v41.27,65.23 v42.55,65.23 | v55.24,60.79 v68.58,60.79
!BUS_IRQ
  Bottom 0.203: SV101.6 82.55,4.45 83.19,5.08 83.19,10.16 83.82,10.79 89.53,10.79 90.81,12.06 90.81,17.14 91.44,17.78 IC101.14
!DONE_1
  Bottom 0.203: SV102.10 9.53,64.77 16.51,64.77 17.14,64.14 IC103.3
!DONE_2
  Bottom 0.203: SV102.8 10.79,62.23 9.53,60.96 IC103.6
!DONE_3
  Bottom 0.203: SV102.6 13.34,62.23 10.79,59.69 10.79,50.16 10.16,49.53 IC103.11
!DONE_4
  Bottom 0.203: SV102.4 15.88,50.16 16.51,49.53 IC103.14
!SLOT_ACK
  Bottom 0.203: SV101.24 60.33,5.71 80.01,5.71 80.64,6.35 80.64,8.26 83.54,11.15 89.26,11.15 90.45,12.34 90.45,18.69 92.08,20.32 IC101.15
!SLOT_AS
  Top 0.203: IC101.8 83.19,23.5 83.19,21.46 71.33,9.6 53.55,9.6 52.2,8.26 50.8,8.26 50.16,7.62 50.16,5.08 49.53,4.45 SV101.32
!SLOT_CS
  Top 0.203: SV101.5 81.92,8.89 82.55,9.53 90.17,9.53 92.71,12.06 IC101.13
!SLOT_DS
  Top 0.203: SV101.31 50.52,8.61 52.05,8.61 53.4,9.96 71.18,9.96 82.83,21.61 82.83,25.73 85.04,27.94 IC101.7
!SLOT_RESET
  Top 0.203: SV101.30 52.07,4.45 52.7,5.08 52.7,8.26 53.7,9.25 71.48,9.25 IC101.9
!TMS_CAS  (via drill 0.35)
  Top 0.203: IC201.5 35.56,59.05 34.92,59.69 32.38,59.69 31.75,59.05 31.75,55.88 29.21,53.34 v29.21,46.35 | v29.21,45.09 29.21,41.46 v29.12,41.37 | IC202.2 30.48,40.01 v29.94,40.55 | v43.81,54.61 v42.55,54.61
  Bottom 0.203: v29.21,46.35 v29.21,45.09 | IC201.5 35.56,55.88 36.83,54.61 v42.55,54.61 | v43.81,54.61 66.67,54.61 68.58,52.7 IC203.20 | v29.94,40.55 v29.12,41.37
!TMS_CS_RD
  Bottom 0.203: IC202.15 63.5,26.67 64.77,25.4 82.55,25.4 83.82,26.67 92.08,26.67 92.71,27.3 IC101.18
!TMS_CS_WR
  Bottom 0.203: IC202.14 60.96,26.04 61.95,25.04 82.27,25.04 83.19,24.13 92.08,24.13 92.71,24.77 IC101.17
!TMS_DONE  (via drill 0.35)
  Top 0.203: SV102.1 v41.27,66.04 | v42.55,66.04 50.8,66.04 v55.24,61.59 | v68.58,61.59 83.82,61.59 85.09,60.33 85.09,46.35 87.27,44.17 87.27,39.01 86.36,38.1 IC101.3
  Bottom 0.203: SV102.9 SV102.7 SV102.5 SV102.3 SV102.1 | v41.27,66.04 v42.55,66.04 | v55.24,61.59 v68.58,61.59
!TMS_IRQ
  Top 0.203: IC101.5 67.31,33.02 66.04,31.75 IC202.16 66.04,22.86 | 66.04,22.86 R205.1 | LED201.C 66.04,22.86
!TMS_RAS  (via drill 0.35)
  Top 0.203: IC202.1 v27.94,38.1 | v28.57,54.61 28.57,57.78 30.84,60.05 39.65,60.05 40.64,59.05 IC201.3
  Bottom 0.203: v27.94,38.1 26.67,39.37 26.67,52.7 v28.57,54.61
!TMS_RD  (via drill 0.35)
  Top 0.203: v63.5,52.07 73.03,52.07 73.66,51.44 IC203.22 | v29.21,34.92 29.21,19.05 30.48,17.78 IC204.11
  Bottom 0.203: IC201.2 43.18,52.07 | 43.18,52.07 IC201.13 | v63.5,52.07 43.18,52.07 | 43.18,52.07 34.92,52.07 34.29,51.44 34.29,36.83 32.38,34.92 v29.21,34.92
!TMS_RESET
  Top 0.203: IC202.34 43.18,35.56 44.45,34.29 89.53,34.29 90.17,33.66 90.17,31.11 90.81,30.48 IC101.19
+5V  (via drill 0.35)
  Top 0.203: 49.85,52.16 C207.+ | IC103.16 22.23,50.8 21.59,51.44 15.24,51.44 14.61,52.07 IC103.4 | R204.1 55.24,20.32 | 55.24,18.41 65.41,18.41 66.04,19.05 R205.2
  Top 0.406: 92.71,47.31 C103.1 92.71,47.94 | C105.+ 92.59,50.69 92.71,50.57 92.71,49.53 IC203.28 | IC204.20 55.24,15.88 | 55.24,15.88 C201.1 | 94.94,72.94 C205.+ | 49.85,52.16 C204.1 IC201.14 IC202.33 45.72,39.69 | 45.72,39.69 C206.1 | C104.1 IC102.20 3.81,22.23 5.08,20.95 v27.94,20.95 | 55.24,15.88 55.24,18.41 55.24,20.32 55.24,20.95 | 55.24,20.95 55.24,24.77 54.61,25.4 v54.61,33.66 | v54.61,34.87 54.56,34.92 46.99,34.92 45.72,36.2 45.72,39.69 | IC103.16 C106.1 25.09,51.12 26.04,52.07 v27.94,52.07 | v41.91,53.34 v43.81,53.34 | v47.62,53.34 48.66,53.34 C207.+ 49.3,63.27 v50.16,64.14 | 55.24,20.95 v53.34,20.95 | v52.07,66.04 53.98,67.94 | 53.98,67.94 58.1,72.07 C203.1 | L201.1 30.84,77.74 40.64,67.94 v41.27,67.94 | v42.55,67.94 53.98,67.94
  Top 0.61: SV101.2 SV101.1 C102.+ | C101.1 91.76,6.9 C102.+ | 92.71,47.31 IC101.24 94.61,43.18 95.25,42.55 95.25,12.06 91.84,8.66 C102.+ | 92.71,47.94 92.71,49.53 | 94.94,72.94 C202.1 IC205.20 88.9,76.83 87.63,78.11 62.87,78.11 61.59,76.83 IC206.20 C203.1 | C205.+ 94.39,55.02 92.59,53.23 92.59,50.69
  Bottom 0.406: v54.61,33.66 v54.61,34.87 | v27.94,52.07 29.21,53.34 v41.91,53.34 | v43.81,53.34 v47.62,53.34 | v53.34,20.95 v27.94,20.95 | v50.16,64.14 v52.07,66.04 | v41.27,67.94 v42.55,67.94
COL
  Top 0.203: IC201.10 41.91,55.88 41.91,72.39 IC206.11
CONFIG_LATCH  (via drill 0.35)
  Top 0.203: v76.82,19.86 v78.33,21.37
  Bottom 0.203: IC102.11 26.67,19.68 27.58,18.77 75.73,18.77 v76.82,19.86 | v78.33,21.37 78.55,21.59 92.08,21.59 92.71,22.23 IC101.16
GND  (via drill 0.35)
  other vias: 0.64,0.64 0.64,3.81 0.64,6.99 0.64,10.16 0.64,13.34 0.64,16.51 0.64,19.68 0.64,22.86 0.64,26.04 0.64,29.21 0.64,32.38 0.64,35.56 0.64,38.73 0.64,41.91 0.64,45.09 0.64,48.26 0.64,51.44 0.64,54.61 0.64,57.78 0.64,60.96 0.64,64.14 0.64,67.31 0.64,70.48 0.64,73.66 0.64,76.83 0.64,80.01 0.64,86.36 0.64,89.53 0.64,95.89 0.64,99.06 3.81,0.64 6.99,0.64 10.16,0.64 13.34,0.64 16.51,0.64 19.68,0.64 22.86,0.64 26.04,0.64 29.21,0.64 32.38,0.64 35.56,0.64 38.73,0.64 41.91,0.64 45.09,0.64 48.26,0.64 51.44,0.64 54.61,0.64 57.78,0.64 60.96,0.64 64.14,0.64 67.31,0.64 70.48,0.64 73.66,0.64 76.83,0.64 80.01,0.64 83.19,0.64 86.36,0.64 89.53,0.64 92.71,0.64 95.89,0.64 99.06,0.64 99.06,3.81 99.06,6.99 99.06,10.16 99.06,13.34 99.06,16.51 99.06,19.68 99.06,22.86 99.06,26.04 99.06,29.21 99.06,32.38 99.06,35.56 99.06,38.73 99.06,41.91 99.06,45.09 99.06,48.26 99.06,51.44 99.06,54.61 99.06,57.78 99.06,60.96 99.06,64.14 99.06,67.31 99.06,70.48 99.06,73.66 99.06,76.83 99.06,80.01 99.06,83.19 99.06,86.36 99.06,89.53 99.06,92.71 99.06,95.89 99.06,99.06 95.89,99.06 92.71,99.06 89.53,99.06 86.36,99.06 83.19,99.06 80.01,99.06 76.83,99.06 73.66,99.06 70.48,99.06 67.31,99.06 64.14,99.06 60.96,99.06 57.78,99.06 54.61,99.06 51.44,99.06 48.26,99.06 45.09,99.06 41.91,99.06 38.73,99.06 35.56,99.06 32.38,99.06 29.21,99.06 26.04,99.06 22.86,99.06 19.68,99.06 16.51,99.06 13.34,99.06 10.16,99.06 6.99,99.06 3.81,99.06 46.99,8.89 53.34,49.53 53.98,52.7 70.48,10.79 76.2,16.51 78.74,19.68 81.92,22.86 73.66,13.97 59.69,69.85 48.26,36.2 60.96,15.88 55.88,32.38 64.77,32.38 64.77,36.83 55.88,36.83 60.33,36.83 60.33,32.38 69.85,36.83 72.39,36.83 74.93,36.83 50.8,36.83 50.8,39.37 53.34,36.83 43.81,67.06 45.72,67.06 48.9,67.06 50.8,67.06 61.59,68.33
  pour Bottom: 0,0 0,99.69 99.69,99.69 99.69,0 0.64,0
  pour Top: 0,0 0,99.69 99.69,99.69 99.69,0 0.64,0
N$1
  Top 0.203: IC201.8 30.48,48.26 31.11,47.62 37.47,47.62 38.1,48.26 IC201.11
N$2
  Top 0.203: IC201.9 IC201.6
N$3
  Top 0.203: C208.+ 28.83,90.24 C209.1 28.89,87.68 L201.2 T201.1
N$4
  Top 0.203: T201.3 16.09,87.63 R203.2 15.46,87.42 15.24,87.63 13.55,87.63 R202.2
N$5
  Top 0.203: C210.+ R203.1
N$6
  Top 0.203: J201.PIN 11.66,95.89 C210.-
N$7
  Top 0.203: LED201.A 59.84,20.32 R204.2
N$8
  Top 0.203: IC103.5 12.06,59.05 12.7,59.69 19.05,59.69 19.68,59.05 IC103.2
N$9
  Top 0.203: IC103.7 6.99,55.88 12.06,50.8 IC103.12
N$10
  Top 0.203: IC103.10 6.99,48.26 8.26,46.99 13.34,46.99 14.61,48.26 IC103.13
N$11
  Top 0.203: R101.2 6.5,9.79 LED101.A
ROW  (via drill 0.35)
  Top 0.203: v65.41,69.41 66.04,70.04 IC205.11
  Bottom 0.203: IC201.4 38.1,57.78 49.31,69 65,69 v65.41,69.41
SLOT_A0  (via drill 0.35)
  Top 0.203: SV101.12 74.93,4.45 75.56,5.08 75.56,7.62 76.83,8.89 v77.47,8.89
  Bottom 0.203: IC202.13 58.42,26.04 59.77,24.69 76.28,24.69 77.47,23.5 v77.47,8.89
SLOT_A1
  Top 0.203: SV101.10 77.47,4.45 78.11,5.08 78.11,14.87 81.02,17.78 IC101.11
SLOT_D0  (via drill 0.35)
  Top 0.203: IC202.17 67.94,27.3 67.94,13.34 67.16,12.54 48.32,12.54 47.81,13.06 44.09,13.06 43.84,13.31 v43.81,13.28 | v40.69,9.39 43.68,9.39 v43.81,9.53
  Bottom 0.203: v43.81,13.28 v43.81,9.53 SV101.35 | IC102.3 8.89,10.79 10.29,9.39 v40.69,9.39
SLOT_D1  (via drill 0.35)
  Top 0.203: IC202.18 71.12,15.24 67.71,11.83 45.95,11.83 45.09,12.7 v41.27,12.7 12.7,12.7 11.43,13.97 IC102.4
  Bottom 0.203: v41.27,12.7 SV101.37
SLOT_D2
  Top 0.203: SV101.39 38.73,8.89 41.59,11.75 42.86,11.75 43.49,11.12 68.27,11.12 73.66,16.51 IC202.19
SLOT_D3
  Top 0.203: IC202.20 76.2,17.65 68.96,10.41 40.89,10.41 40.01,9.53 40.01,5.08 39.37,4.45 SV101.40
SLOT_D4  (via drill 0.35)
  Top 0.203: v42.55,10.99 42.77,10.77 68.58,10.77 74.93,17.12 v74.93,29.84
  Bottom 0.203: IC202.21 76.2,31.11 v74.93,29.84 | v42.55,10.99 42.55,5.08 41.91,4.45 SV101.38
SLOT_D5  (via drill 0.35)
  Top 0.203: v45.09,11.7 45.31,11.48 67.99,11.48 72.39,15.88 v72.39,29.84
  Bottom 0.203: IC202.22 73.66,31.11 v72.39,29.84 | v45.09,11.7 45.09,5.08 44.45,4.45 SV101.36
SLOT_D6  (via drill 0.35)
  Top 0.203: v47.62,12.41 47.85,12.19 67.43,12.19 69.85,14.61 v69.85,29.84
  Bottom 0.203: IC202.23 71.12,31.11 v69.85,29.84 | v47.62,12.41 47.62,5.08 46.99,4.45 SV101.34
SLOT_D7  (via drill 0.35)
  Top 0.203: v67.31,29.84 67.31,13.34 66.88,12.9 48.56,12.9 48.3,13.16 v48.3,13.38
  Bottom 0.203: IC202.24 68.58,31.11 v67.31,29.84 | SV101.33 46.35,12.7 46.99,13.34 48.26,13.34 v48.3,13.38
SLOT_R/!W!
  Top 0.203: SV101.23 59.05,8.26 59.69,8.89 71.62,8.89 83.05,20.32 IC101.10
TMS_AD0  (via drill 0.35)
  Top 0.203: IC204.2 IC202.10 | v40.01,77.47 41.27,78.74 IC206.9 41.27,85.09 44.4,88.21 68.35,88.21 v68.58,88.44
  Bottom 0.203: IC202.10 50.8,29.21 49.81,30.2 44.47,30.2 41.01,33.66 27.23,33.66 26.3,34.59 26.3,66.3 37.69,77.7 39.78,77.7 v40.01,77.47 | v68.58,88.44 IC205.9
TMS_AD1  (via drill 0.35)
  Top 0.203: IC202.9 IC204.3 | v42.55,77.47 43.81,78.74 IC206.8 43.81,85.09 46.58,87.86 70.89,87.86 v71.12,88.08
  Bottom 0.203: IC202.9 48.26,29.21 47.62,29.84 44.32,29.84 40.91,33.25 27.13,33.25 25.94,34.44 25.94,66.45 37.54,78.05 40.88,78.05 41.46,77.47 v42.55,77.47 | v71.12,88.08 IC205.8
TMS_AD2  (via drill 0.35)
  Top 0.203: IC204.4 IC202.8 | v45.09,77.47 46.35,78.74 IC206.7 46.35,85.09 48.77,87.5 73.43,87.5 v73.66,87.73
  Bottom 0.203: IC202.8 40.77,32.89 26.98,32.89 25.59,34.29 25.59,66.6 37.4,78.41 42.88,78.41 43.81,77.47 v45.09,77.47 | v73.66,87.73 IC205.7
TMS_AD3  (via drill 0.35)
  Top 0.203: IC202.7 IC204.5 | v47.62,77.47 48.9,78.74 IC206.6 48.9,85.09 50.95,87.15 75.97,87.15 v76.2,87.37
  Bottom 0.203: IC202.7 38.58,32.54 26.82,32.54 25.23,34.12 25.23,66.75 37.25,78.76 45.25,78.76 46.54,77.47 v47.62,77.47 | v76.2,87.37 IC205.6
TMS_AD4  (via drill 0.35)
  Top 0.203: IC204.6 IC202.6 | v50.16,77.47 51.44,78.74 IC206.5 51.44,85.09 53.14,86.79 78.51,86.79 v78.74,87.02
  Bottom 0.203: IC202.6 36.4,32.18 26.67,32.18 24.88,33.98 24.88,66.89 37.1,79.12 47.43,79.12 49.08,77.47 v50.16,77.47 | v78.74,87.02 IC205.5
TMS_AD5  (via drill 0.35)
  Top 0.203: IC202.5 IC204.7 | v52.7,77.47 53.98,78.74 IC206.4 53.98,85.09 55.32,86.44 81.05,86.44 v81.28,86.66
  Bottom 0.203: IC202.5 34.21,31.83 26.52,31.83 24.52,33.83 24.52,67.04 36.95,79.47 49.62,79.47 51.62,77.47 v52.7,77.47 | v81.28,86.66 IC205.4
TMS_AD6  (via drill 0.35)
  Top 0.203: IC204.8 IC202.4 | v55.24,77.47 56.52,78.74 IC206.3 56.52,85.09 57.51,86.08 83.54,86.08 v83.82,86.36
  Bottom 0.203: IC202.4 32.03,31.47 26.38,31.47 24.17,33.68 24.17,67.19 36.81,79.83 51.8,79.83 54.16,77.47 v55.24,77.47 | v83.82,86.36 IC205.3
TMS_AD7  (via drill 0.35)
  Top 0.203: IC202.3 IC204.9 | v57.78,77.47 59.05,78.74 IC206.2 59.05,85.09 59.69,85.72 85.72,85.72 86.36,85.09 IC205.2
  Bottom 0.203: IC202.3 33.02,29.21 31.11,31.11 26.23,31.11 23.81,33.53 23.81,67.33 36.66,80.19 53.99,80.19 56.7,77.47 v57.78,77.47
TMS_CLK3  (via drill 0.35)
  Top 0.203: v22.23,41.91 26.04,41.91 v27.3,40.64
  Bottom 0.203: IC103.9 4.45,46.99 9.53,41.91 v22.23,41.91 | v27.3,40.64 28.57,39.37 32.38,39.37 33.02,40.01 IC202.38
TMS_R/!W!  (via drill 0.35)
  Top 0.203: v67.31,31.75 v76.83,31.75 | IC201.1 45.72,55.24 44.45,53.98 v44.45,35.56 | v53.34,32.38 IC202.11 IC204.1
  Bottom 0.203: IC202.11 53.34,29.21 54.61,30.48 65.41,30.48 66.67,31.75 v67.31,31.75 | v76.83,31.75 80.01,31.75 80.64,32.38 80.64,45.09 81.28,45.72 85.72,45.72 86.36,46.35 IC203.27 | v44.45,35.56 44.45,33.66 45.72,32.38 v53.34,32.38
TMS_VD0  (via drill 0.35)
  Top 0.203: IC203.11 63.5,53.34 62.23,52.07 62.23,42.5 60.3,40.56 52.07,40.56 | 52.07,40.56 49.61,40.56 48.26,41.91 IC202.32 | IC204.19 50.8,17.78 52.07,19.05 v52.07,33.66 | v52.07,39.37 52.07,40.56
  Bottom 0.203: v52.07,33.66 v52.07,39.37
TMS_VD1  (via drill 0.35)
  Top 0.203: IC203.12 60.96,53.34 59.69,52.07 59.69,42.5 58.11,40.92 51.79,40.92 50.8,41.91 IC202.31 | IC204.18 48.26,17.78 49.53,19.05 v49.53,33.66
  Bottom 0.203: v49.53,33.66 49.53,42.55 50.16,43.18 IC202.31
TMS_VD2  (via drill 0.35)
  Top 0.203: IC203.13 58.42,53.34 57.15,52.07 57.15,41.91 56.52,41.27 53.98,41.27 53.34,41.91 IC202.30 | IC204.17 45.72,17.78 46.99,19.05 v46.99,33.66
  Bottom 0.203: v46.99,33.66 46.99,44.45 48.26,45.72 52.7,45.72 53.34,45.09 IC202.30
TMS_VD3  (via drill 0.35)
  Top 0.203: IC203.15 IC202.29 | IC204.16 43.18,17.78 44.45,19.05 44.45,32.38 v45.72,33.66
  Bottom 0.203: v45.72,33.66 45.72,40.01 44.45,41.27 44.45,45.09 45.44,46.08 54.25,46.08 55.88,44.45 IC202.29
TMS_VD4  (via drill 0.35)
  Top 0.203: IC202.28 IC203.16 | IC204.15 40.64,17.78 41.91,19.05 v41.91,41.27
  Bottom 0.203: v41.91,41.27 41.91,44.45 43.89,46.43 56.44,46.43 58.42,44.45 IC202.28
TMS_VD5  (via drill 0.35)
  Top 0.203: IC203.17 IC202.27 | IC204.14 38.1,17.78 39.37,19.05 v39.37,41.27
  Bottom 0.203: v39.37,41.27 39.37,44.45 41.71,46.79 58.62,46.79 60.96,44.45 IC202.27
TMS_VD6  (via drill 0.35)
  Top 0.203: IC202.26 IC203.18 | IC204.13 35.56,17.78 36.83,19.05 36.83,30.48 38.73,32.38 38.73,41.86 39.01,42.14 39.01,42.19 39.37,42.55 39.37,45.27 v39.91,45.81
  Bottom 0.203: v39.91,45.81 40.23,45.81 41.56,47.14 60.81,47.14 63.5,44.45 IC202.26
TMS_VD7  (via drill 0.35)
  Top 0.203: IC203.19 IC202.25 | v40.01,46.99 32.38,46.99 31.75,46.35 v31.75,46.3 | IC204.12 33.02,17.78 31.75,19.05 v31.75,45.09
  Bottom 0.203: IC202.25 66.04,44.45 62.99,47.5 40.51,47.5 v40.01,46.99 | v31.75,46.3 v31.75,45.09
TMS_VID_OUT  (via drill 0.35)
  Top 0.203: T201.2 R201.2 | IC202.36 38.1,45.09 37.47,45.72 v3.17,45.72
  Bottom 0.203: v3.17,45.72 3.17,83.19 9.53,89.53 T201.2
TMS_X1
  Top 0.203: C211.2 11.24,37.97 Q201.1 25.91,37.97 27.94,40.01 IC202.40
TMS_X2
  Top 0.203: C212.2 19.56,33.02 Q201.2 21.72,33.15 30.48,41.91 IC202.39
VDP_RESET  (via drill 0.35)
  Top 0.203: v76.83,19.05 82.47,24.69 82.47,27.86 IC101.6
  Bottom 0.203: IC102.5 13.97,17.78 14.61,18.41 76.2,18.41 v76.83,19.05
VRAM_A0
  Top 0.203: IC203.10 66.04,68.58 68.58,71.12 IC205.12
VRAM_A1
  Top 0.203: IC205.13 71.12,71.12 68.58,68.58 IC203.9
VRAM_A2
  Top 0.203: IC203.8 71.12,68.58 73.66,71.12 IC205.14
VRAM_A3
  Top 0.203: IC205.15 76.2,71.12 73.66,68.58 IC203.7
VRAM_A4
  Top 0.203: IC205.16 78.74,71.12 76.2,68.58 IC203.6
VRAM_A5
  Top 0.203: IC203.5 78.74,68.58 81.28,71.12 IC205.17
VRAM_A6
  Top 0.203: IC205.18 83.82,71.12 81.28,68.58 IC203.4
VRAM_A7  (via drill 0.35)
  Top 0.203: v85.09,71.58 85.09,67.31 83.82,66.04 IC203.3
  Bottom 0.203: IC206.17 53.98,73.66 54.89,72.75 63.52,72.75 64.5,71.77 84.91,71.77 v85.09,71.58
VRAM_A8
  Bottom 0.203: IC203.25 80.01,50.8 80.01,70.48 79.44,71.06 64.2,71.06 63.22,72.03 51.29,72.03 48.9,74.43 IC206.15
VRAM_A9
  Bottom 0.203: IC206.14 46.35,74.3 48.97,71.68 63.07,71.68 64.05,70.7 76.62,70.7 77.47,69.85 77.47,50.8 IC203.24
VRAM_A10
  Bottom 0.203: IC203.21 69.85,50.8 69.85,69.22 69.08,69.99 63.76,69.99 62.78,70.97 44.45,70.97 41.27,74.14 IC206.12
VRAM_A11
  Bottom 0.203: IC206.13 43.81,74.3 46.79,71.32 62.93,71.32 63.91,70.34 74.44,70.34 74.93,69.85 74.93,50.8 IC203.23
VRAM_A12  (via drill 0.35)
  Top 0.203: IC203.2 86.36,66.04 85.72,66.67 85.72,72.39 v85.09,73.03
  Bottom 0.203: IC206.18 56.52,74.3 57.71,73.1 63.66,73.1 64.64,72.12 84.19,72.12 v85.09,73.03
VRAM_A13
  Bottom 0.203: IC203.26 82.55,50.8 82.55,69.85 80.99,71.41 64.35,71.41 63.37,72.39 52.07,72.39 51.44,73.03 IC206.16
VRAM_BANK  (via drill 0.35)
  Top 0.203: v27.94,19.68 8.26,19.68 6.35,17.78 IC102.2 R101.1 | v76.83,20.95 82.12,26.24 82.12,28.01 82.55,28.44 v82.55,31.75 | v82.55,36.83 86.36,36.83 87.63,38.1 87.63,62.23 88.9,63.5 IC203.1
  Bottom 0.203: v27.94,19.68 28.5,19.13 75.01,19.13 v76.83,20.95 | v82.55,31.75 v82.55,36.83

### Text on the board
tNames: 68komputer TMS9918 Video Board | Rev 01 - By Tristan Seifert | Video Out | Wait States | 1 2 3 4 0